# Altium schematic sheet [F_V1]_Sensors_And_BlockControl_Sheet.SchDoc
size A2; SheetNumber: 5; SheetTotal: 5
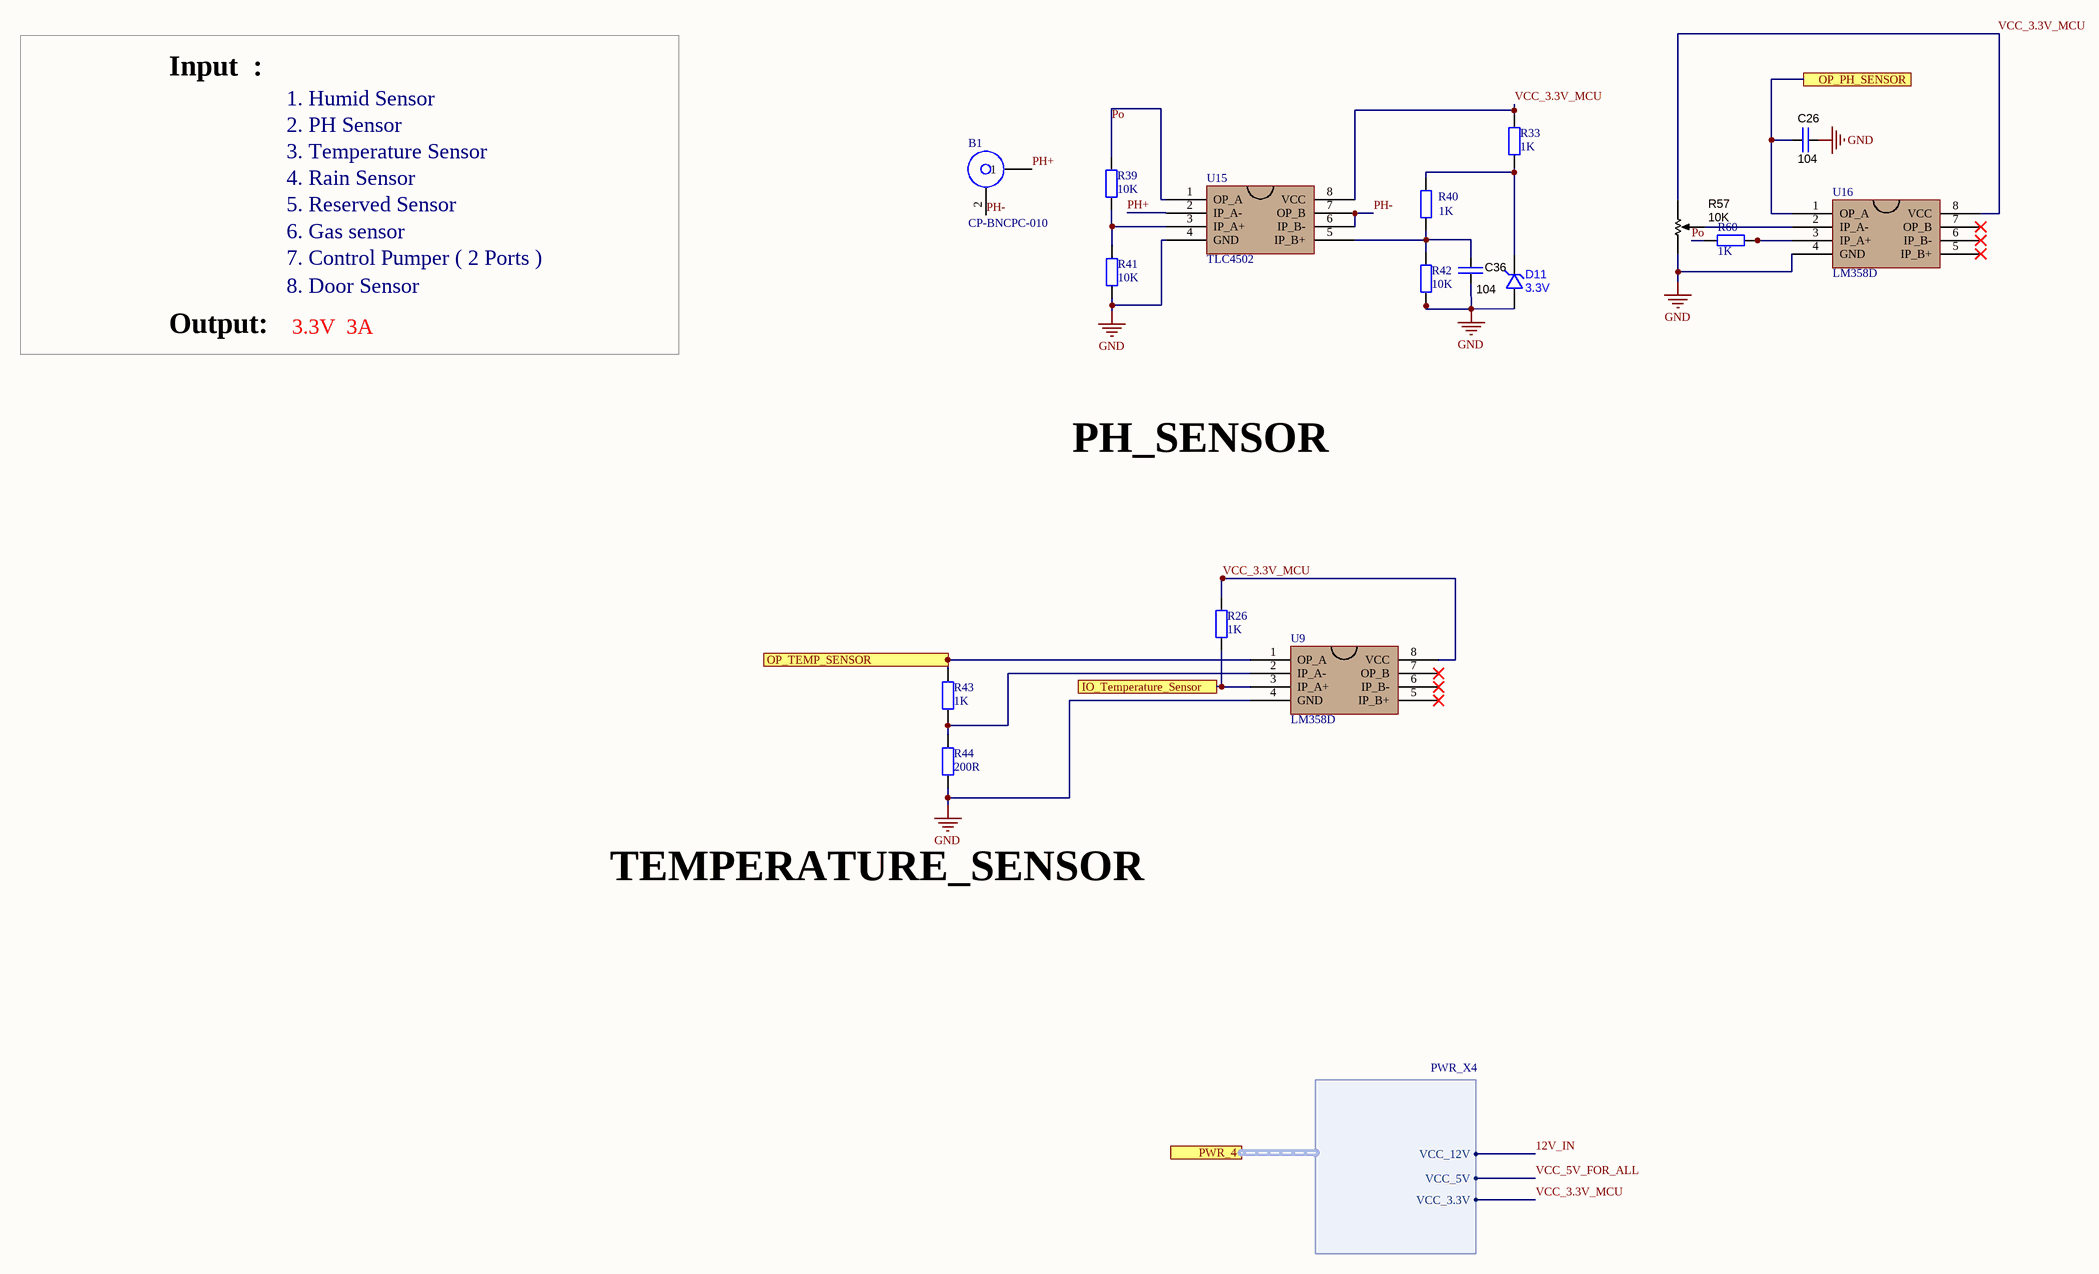
[diagram p0: [F_V1]_Sensors_And_BlockControl_Sheet.SchDoc]

## Parts
B1  CP-BNCPC-010  [BNC]
C26  104  [CAPC1608X90N]
C36  104  [CAPC1608X90N]
D11  3.3V  [SOD323]
R26  1K  [RESC-0603 (1608)]
R33  1K  [RESC-0603 (1608)]
R39  10K  [RESC-0603 (1608)]
R40  1K  [RESC-0603 (1608)]
R41  10K  [RESC-0603 (1608)]
R42  10K  [RESC-0603 (1608)]
R43  1K  [RESC-0603 (1608)]
R44  200R  [RESC-0603 (1608)]
R57  value 10K  [TrimPot_THT_2.54mm pitch]  (hidden comment: 25 Turn)
R60  1K  [RESC-0603 (1608)]
U9  LM358D  [LM358]
U15  TLC4502  [TLC4502]
U16  LM358D  [LM358]

## Ports
IO_Temperature_Sensor, OP_PH_SENSOR, OP_TEMP_SENSOR, PWR_4 (harness PWR_X4)

## Harnesses
PWR_X4: VCC_12V, VCC_5V, VCC_3.3V

## Nets
GND: C26.2 C36.2 D11.A R41.1 R42.1 R44.1 R57.1(CCW) U9.4(GND) U15.4(GND) U16.4(GND)
12V_IN: port PWR_4.VCC_12V
IO_Temperature_Sensor: R26.1 U9.3(IP_A+) ; port IO_Temperature_Sensor
OP_PH_SENSOR: C26.1 U16.1(OP_A) ; port OP_PH_SENSOR
OP_TEMP_SENSOR: R43.2 U9.1(OP_A) ; port OP_TEMP_SENSOR
PH+: B1.1 U15.2(IP_A-)
PH-: B1.2 U15.6(IP_B-) U15.7(OP_B)
Po: R39.2 R60.2 U15.1(OP_A)
VCC_3.3V_MCU: R26.2 R33.2 R57.3(CW) U9.8(VCC) U15.8(VCC) U16.8(VCC) ; port PWR_4.VCC_3.3V
VCC_5V_FOR_ALL: port PWR_4.VCC_5V
NetC36_1: C36.1 R40.1 R42.2 U15.5(IP_B+)
NetD11_K: D11.K R33.1 R40.2
NetR39_1: R39.1 R41.2 U15.3(IP_A+)
NetR43_1: R43.1 R44.2 U9.2(IP_A-)
NetR57_2: R57.2(TAP) U16.2(IP_A-)
NetR60_1: R60.1 U16.3(IP_A+)

Not connected (* = marked no-connect by the designer): U9 5(IP_B+)* 6(IP_B-)* 7(OP_B)*; U16 5(IP_B+)* 6(IP_B-)* 7(OP_B)*

## Notes on the sheet
- Input  :
- 1. Humid Sensor
- 2. PH Sensor
- 3. Temperature Sensor
- 4. Rain Sensor
- 5. Reserved Sensor
- 6. Gas sensor
- 7. Control Pumper ( 2 Ports )
- 8. Door Sensor
- Output:
- 3.3V  3A
- PH_SENSOR
- TEMPERATURE_SENSOR

## Library data of the parts
C26 C36 = CAP C_0603: Capacitor SMD Cer 470nF 10% 16V X7R 0603; Manufacturer 1: Murata Electronics North America; Manufacturer Part Number 1: GRM188R71C474KA88D; Ratings: 16V; X7R; Material: ceramic; SCDType: spec; Package / Case: 0603 (1608 metric); Tolerance: ±10%; Manufacturer 2: TDK Corporation; Manufacturer Part Number 2: C1608X7R1C474K; Supplier 1: Digi-Key; Supplier Part Number 1: 490-3295-2-ND; Supplier 2: Digi-Key; Supplier Part Number 2: 445-5192-2-ND; Supplier 3: Digi-Key; Supplier Part Number 3: 587-1250-2-ND; Manufacturer 3: Taiyo Yuden; Manufacturer Part Number 3: EMK107B7474KA-T; Manufacturer 4: Samsung; Manufacturer Part Number 4: CL10B474KONE; ComponentLink1URL: http://psearch.murata.com/capacitor/product/GRM188R71C474KA88#.pdf; ComponentLink1Description: http://psearch.murata.com/capacitor/product/GRM188R71C474KA88#.pdf; ComponentLink2URL: http://product.tdk.com/capacitor/mlcc/en/documents/mlcc_commercial_general_en.pdf; ComponentLink2Description: http://product.tdk.com/capacitor/mlcc/en/documents/mlcc_commercial_general_en.pdf; ComponentLink3URL: http://www.yuden.co.jp/or/product/category/capacitor/EMK107B7474KA-T.pdf; ComponentLink3Description: http://www.yuden.co.jp/or/product/category/capacitor/EMK107B7474KA-T.pdf; Value: 104
D11 = DIODE_ZENER_3V3_SOD323: Diode Zener SMD 3.3V 200mW SOD-323; Manufacturer 1: ON Semiconductor; Manufacturer Part Number 1: MM3Z3V3ST1G; Ratings: 3.3V; 0.2W; Vf=900mV @ 10mA; Material: Si; Tolerance: ±3%; SCDType: source; Package / Case: SOD-323; Diode Type: Zener; Supplier 1: Digi-Key; Supplier Part Number 1: MM3Z3V3ST1GOSCT-ND
R26 R33 R39-R44 R60 = CRCW06035R10FKEA: RES SMD 5.1 OHM 1% 1/10W 0603; MFR: Vishay Dale; Value: 5.1R; Solder: SMT; MPN: CRCW06035R10FKEA; Category: RESISTOR; PinCount: 2
R57 = RES_TRIMMER_1K_25T_THT: Trimmer, 25-Turn, 1K cermet; Manufacturer 1: Murata Electronics North America; Manufacturer Part Number 1: PV36Y102C01B00; Tolerance: 10%; Ratings: 25 turn variable cermet; SCDType: spec; Supplier 1: Digi-Key; Supplier Part Number 1: 490-2912-ND